# EAGLE design BigClown_WiFi_module (EAGLE 9.2.2)
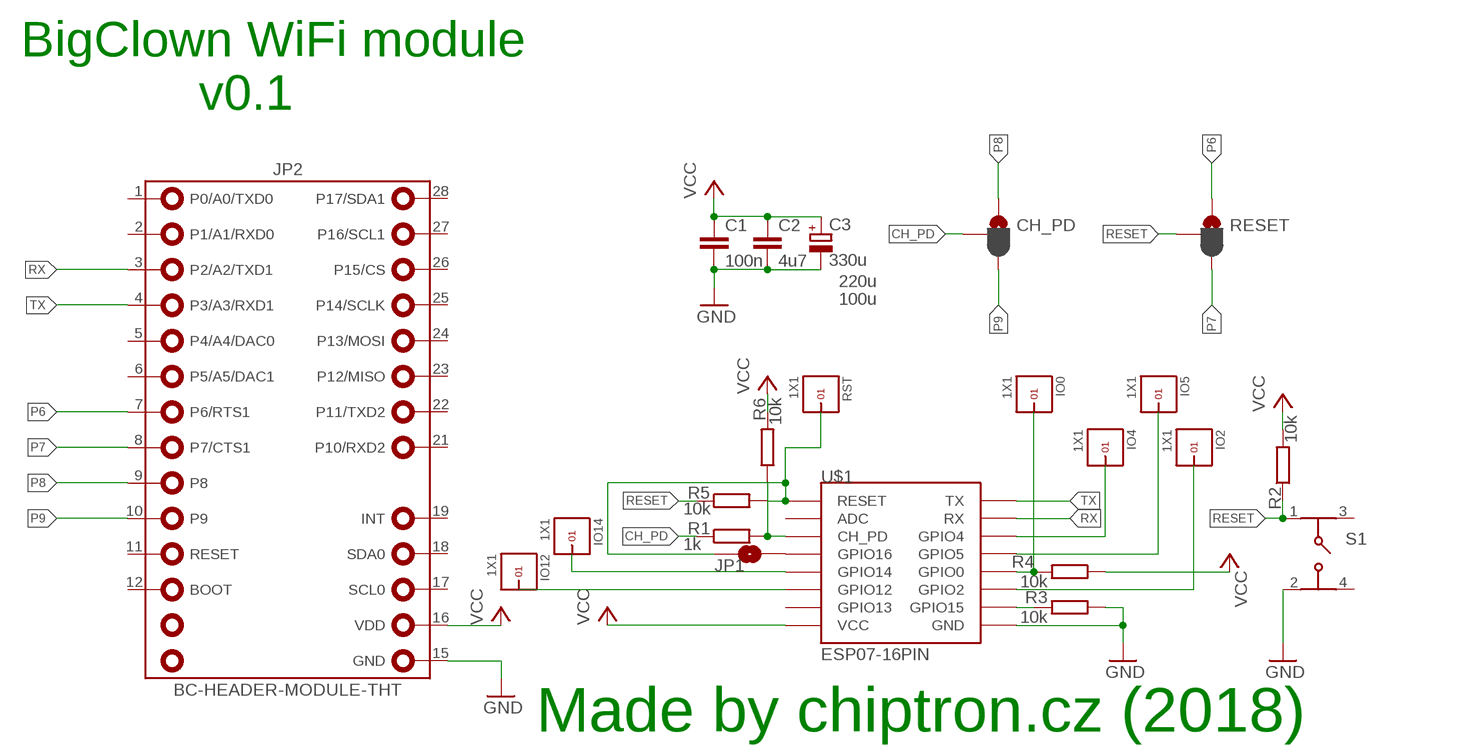
[diagram p0: schematic, sheet 1]

## Parts
C1  100n  C-EUC0805  [C0805]
C2  4u7  C-EUC1812K  [C1812K]
C3  330u  CPOL-EUD/7343-31R  [D/7343-31R]
CH_PD  JUMPER-SMT_3_1-NC_PASTE_SILK  [SMT-JUMPER_3_1-NC_PASTE_SILK]
IO0  1X1  [1X1]
IO2  1X1  [1X1]
IO4  1X1  [1X1]
IO5  1X1  [1X1]
IO12  1X1  [1X1]
IO14  1X1  [1X1]
JP1  JUMPER-SMT_2_NO_NO-SILK  [SMT-JUMPER_2_NO_NO-SILK]
JP2  BC-HEADER-MODULE-THT  [BC-HEADER-MODULE-THT]
R1  1k  R-EU_M0805  [M0805]
R2  10k  R-EU_M0805  [M0805]
R3  10k  R-EU_M0805  [M0805]
R4  10k  R-EU_M0805  [M0805]
R5  10k  R-EU_M0805  [M0805]
R6  10k  R-EU_M0805  [M0805]
RESET  JUMPER-SMT_3_1-NC_PASTE_SILK  [SMT-JUMPER_3_1-NC_PASTE_SILK]
RST  1X1  [1X1]
S1  430152043826  [430152043826]
U$1  ESP07-16PIN  [ESP07-16PIN]

## Nets
CH_PD: CH_PD.2 R1.1
GND: C1.2 C2.2 C3.- JP2.15(GND) R3.1 S1.2 U$1.GND
N$1: R1.2 R6.1 U$1.CH_PD
N$2: IO0.1 R4.2 U$1.GPIO0
N$3: R3.2 U$1.GPIO15
N$4: JP1.1 R5.2 RST.1 U$1.REST(RESET)
N$5: JP1.2 U$1.GPIO16
N$6: IO12.1 U$1.GPIO12
N$7: IO14.1 U$1.GPIO14
N$8: IO4.1 U$1.GPIO4
N$9: IO5.1 U$1.GPIO5
N$10: IO2.1 U$1.GPIO2
P6: JP2.7(P6/RTS1) RESET.1
P7: JP2.8(P7/CTS1) RESET.3
P8: CH_PD.1 JP2.9(P8)
P9: CH_PD.3 JP2.10(P9)
RESET: R2.1 R5.1 RESET.2 S1.1
RX: JP2.3(P2/A2/TXD1) U$1.RX
TX: JP2.4(P3/A3/RXD1) U$1.TX
VCC: C1.1 C2.1 C3.+ JP2.16(VDD) R2.2 R4.1 R6.2 U$1.VCC
Unconnected: JP2.1(P0/A0/TXD0) JP2.2(P1/A1/RXD03) JP2.5(P4/A4/DAC0) JP2.6(P5/A5/DAC1) JP2.11(RESET) JP2.12(BOOT) JP2.17(SCL0) JP2.18(SDA0) JP2.19(INT) JP2.21(P10/RXD2) JP2.22(P11/TXD2) JP2.23(P12/MISO) JP2.24(P13/MOSI) JP2.25(P14/SCLK) JP2.26(P15/CS) JP2.27(P16/SCL1) JP2.28(P17/SDA1) S1.3 S1.4 U$1.ADC U$1.GPIO13

## Notes on the sheet
- BigClown WiFi module
- v0.1
- 220u
- 100u
- Made by chiptron.cz (2018)

## Library data of the parts
C1 C2 = rcl:C-EU: CAPACITOR, European symbol; SPICEPREFIX: C
C3 = rcl:CPOL-EU: POLARIZED CAPACITOR, European symbol; SPICEPREFIX: C
CH_PD RESET = SparkFun-Jumpers:JUMPER-SMT_3_1-NC_PASTE: Normally closed solder jumper (1 of 2 connections) This jumper has an aperture in the stencil to allow solder paste to bridge one of the two connections. One connection is normally closed (NC), while the other is normally open (NO). Wick off the solder to open the connection. Reapply solder to reclose the connection. Apply solder to the other side instead to change the current path.
IO0 IO2 IO4 IO5 IO12 IO14 RST = headers_2mm:1X1
JP1 = SparkFun-Jumpers:JUMPER-SMT_2_NO: Normally open jumper This jumper has two pads in close proximity to each other. Apply solder to close the connection. Round pads are easier to solder for beginners, but are a lot larger. SparkFun Product that uses the round pads: SparkFun EL Sequencer <https://www.sparkfun.com/products/12781>
JP2 = bc-header:BC-HEADER-MODULE-THT: 14pin THT pin header or socket or long pin socket + 14pin THT pin header or socket or long pin socket empty pin 6 Use this pattern for THT connection only. Mounting Technology: THT; BCPN: -
R1-R6 = rcl:R-EU_: RESISTOR, European symbol; SPICEPREFIX: R
S1 = Wurth_Elektronik_Electromechanic_Switch_rev17c:430152043826: 6x6 mm SMD WS-TASV <http://katalog.we-online.de/media/images/v2/Family_WS-TASV_6x6mm_SMD_Tact_Switch_4301820xx8xx.jpg> Details see: http://katalog.we-online.de/em/datasheet/4301x2xxx8x6.pdf 2015 (C) Würth Elektronik
U$1 = esp8266modules:ESP07-16PIN: ESP8266 Wifi module 07 - 16 pins; DIMENSIONS: 22.0 x 16.0 mm; PINS: 16; PITCH: 0.078" / 2 mm

## Board
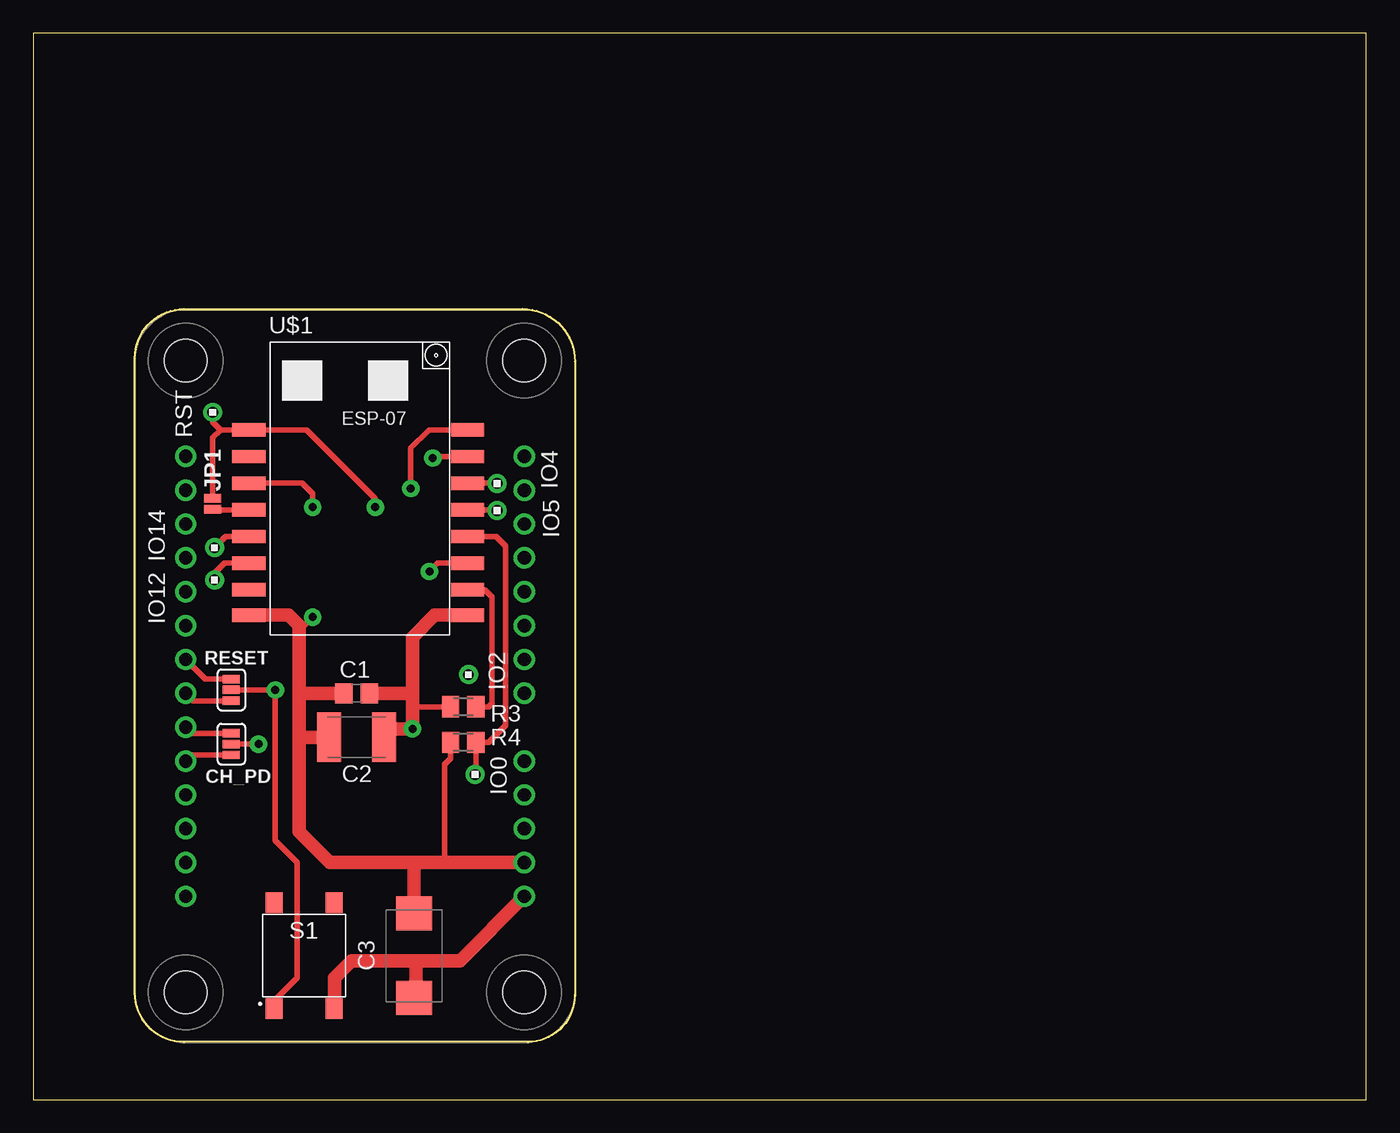
[diagram p1: board, top side]
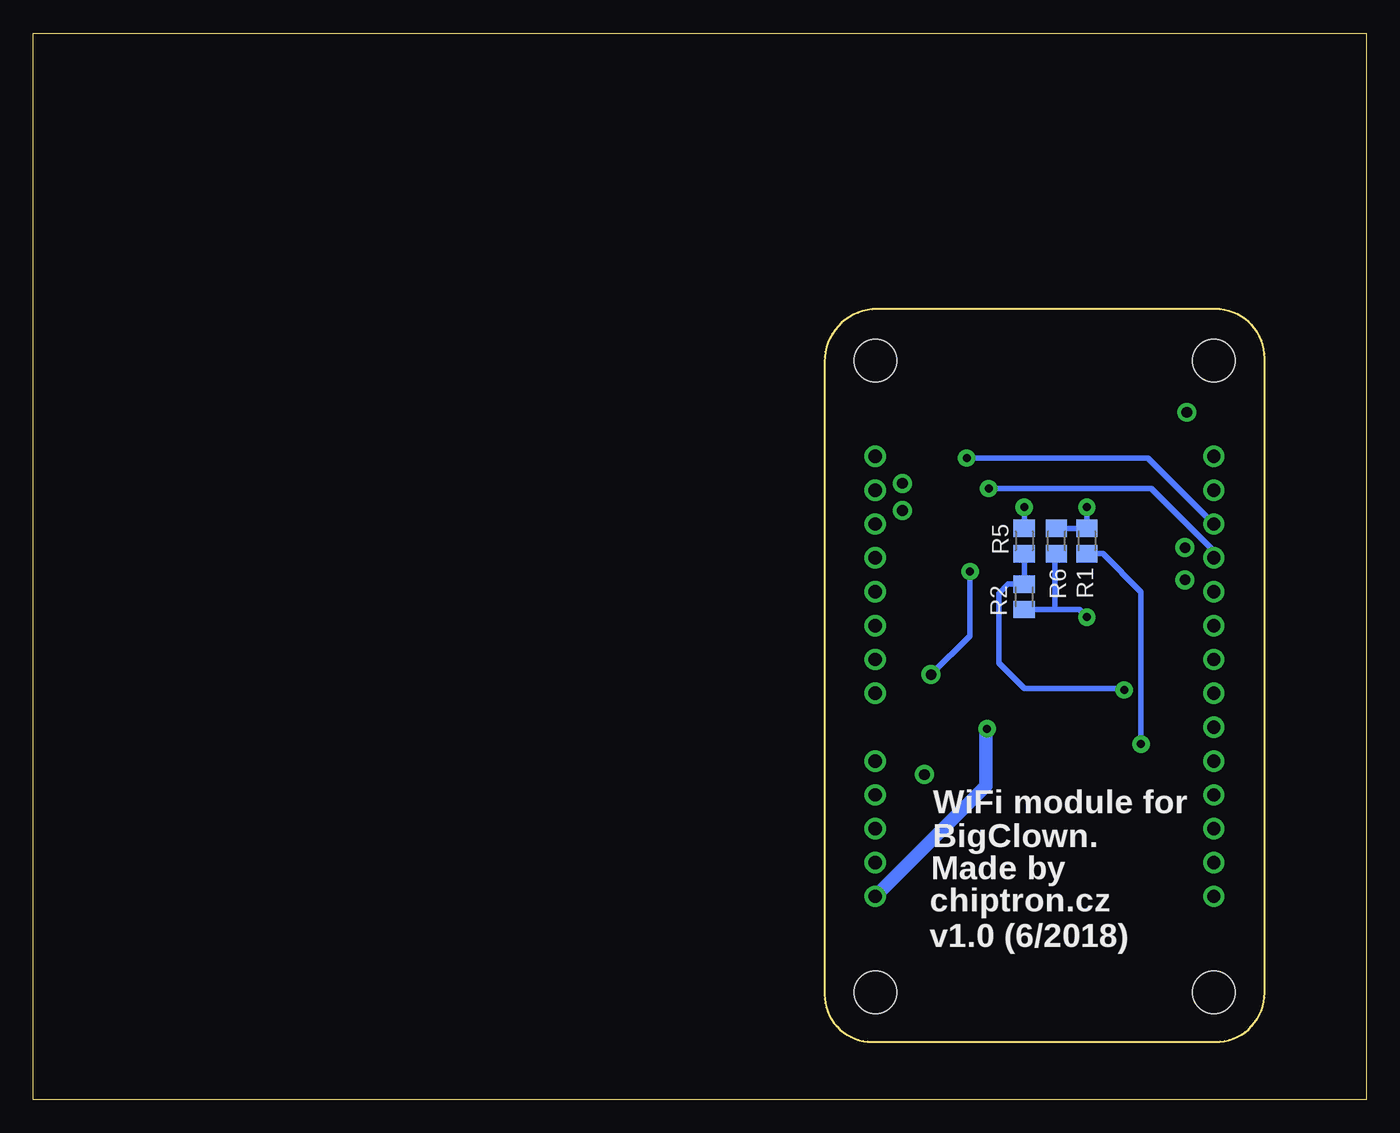
[diagram p2: board, bottom side, seen from below]

Size 100 x 80 mm. Coordinates in mm from the lower left corner, seen from the top.
Outline: 0,0 100,0 100,80 0,80 0,0
Copper layers (1*16): Top 0.035mm / dielectric 1.5mm / Bottom 0.035mm
Design rules "default": minimum track width 6mil, minimum drill 0.35mm, track to track 6mil, track to pad 6mil, pad to pad 6mil, via to via 6mil, smd to smd 6mil, copper to edge 40mil, drill to drill 6mil, minimum pad ring 10mil, minimum via ring 8mil, stop-mask expansion 4mil, vias tented up to drill 0mil, thermal gap 10mil
Milling: 8 lines

### Footprints (pad centres in the part's own frame; a part is rotated, then mirrored left to right if it is on the bottom)
C0805 = smd 1.3 x 1.5: 1 -0.95,0; 2 0.95,0
C1812K = smd 1.8 x 3.7: 1 -2.05,0; 2 2.05,0
D/7343-31R = smd 2.55 x 2.7: + 3.175,0; - -3.175,0
SMT-JUMPER_3_1-NC_PASTE_SILK = smd 0.635 x 1.27: 1 -0.813,0; 2 0,0; 3 0.813,0
1X1 = drill 0.8 pad 1.422: 1 0,0
SMT-JUMPER_2_NO_NO-SILK = smd 0.635 x 1.27: 1 -0.406,0; 2 0.406,0
BC-HEADER-MODULE-THT = drill 1 pad 1.6: 1 -12.7,16.51; 2 -12.7,13.97; 3 -12.7,11.43; 4 -12.7,8.89; 5 -12.7,6.35; 6 -12.7,3.81; 7 -12.7,1.27; 8 -12.7,-1.27; 9 -12.7,-3.81; 10 -12.7,-6.35; 11 -12.7,-8.89; 12 -12.7,-11.43; 13 -12.7,-13.97; 14 -12.7,-16.51; 15 12.7,-16.51; 16 12.7,-13.97; 17 12.7,-11.43; 18 12.7,-8.89; 19 12.7,-6.35; 21 12.7,-1.27; 22 12.7,1.27; 23 12.7,3.81; 24 12.7,6.35; 25 12.7,8.89; 26 12.7,11.43; 27 12.7,13.97; 28 12.7,16.51 | hole 3.2: -12.7,23.7; 12.7,23.7; -12.7,-23.7; 12.7,-23.7
M0805 = smd 1.3 x 1.6: 1 -0.95,0; 2 0.95,0
430152043826 = smd 1.55 x 1.3: 1 -3.975,2.25; 2 -3.975,-2.25; 3 3.975,2.25; 4 3.975,-2.25
ESP07-16PIN = smd 2.5 x 1: ADC -8.2,3.8; CH_PD -8.2,1.8; GND 8.2,-8.105; GPIO0 8.2,-2.2; GPIO2 8.2,-4.2; GPIO4 8.2,1.8; GPIO5 8.2,-0.2; GPIO12 -8.2,-4.2; GPIO13 -8.2,-6.2; GPIO14 -8.2,-2.2; GPIO15 8.2,-6.2; GPIO16 -8.2,-0.2; REST -8.2,5.8; RX 8.2,3.8; TX 8.2,5.8; VCC -8.2,-8.105

### Placement (x,y rotation side)
C1  24.26,30.48 0 top
C2  24.26,27.18 0 top
C3  28.57,10.79 90 top
CH_PD  14.86,26.67 270 top
IO0  33.15,24.38 0 top
IO2  32.64,31.88 0 top
IO4  34.8,46.23 0 top
IO5  34.8,44.2 0 top
IO12  13.59,38.99 0 top
IO14  13.59,41.4 0 top
JP1  13.46,44.7 270 top
JP2  24.13,31.75 0 top
R1  20.95,41.91 90 bottom
R2  25.65,37.72 270 bottom
R3  32.26,29.46 0 top
R4  32.26,26.8 0 top
R5  25.65,41.91 90 bottom
R6  23.24,41.91 270 bottom
RESET  14.86,30.73 270 top
RST  13.46,51.56 0 top
S1  20.32,10.79 90 top
U$1  24.38,44.45 0 top

### Tracks (layer width: path | path; a pad name or v marks a point on that pad's centre or on a via)
CH_PD  (via drill 0.6 pad 1.3)
  Top 0.406: v16.89,26.67 CH_PD.2
  Bottom 0.406: v16.89,26.67 16.89,38.1 19.75,40.96 R1.1
GND  (via drill 0.6 pad 1.3)
  Top 0.406: R3.1 28.7,29.46 28.45,31.37
  Top 1.016: S1.2 22.61,6.86 22.61,9.14 23.88,10.41 28.7,10.41 | 28.7,10.41 32,10.41 JP2.15 | C3.- 28.7,7.75 28.7,10.41 | 28.45,30.61 v28.45,27.81 26.94,27.81 C2.2 | 28.45,30.61 28.45,31.37 28.45,34.67 30.12,36.34 U$1.GND | C1.2 28.32,30.48 28.45,30.61
  Bottom 1.016: v28.45,27.81 28.54,27.72 28.54,23.53 JP2.15
N$1  (via drill 0.6 pad 1.3)
  Top 0.406: v20.95,44.45 20.95,45.47 20.17,46.25 U$1.CH_PD
  Bottom 0.406: v20.95,44.45 R1.2 R6.1
N$2
  Top 0.406: U$1.GPIO0 34.71,42.25 35.43,41.53 35.43,28.07 34.16,26.8 R4.2 33.21,24.45 IO0.1
N$3
  Top 0.406: R3.2 34.16,29.46 34.42,29.72 34.42,37.72 33.91,38.23 32.61,38.23 | 32.61,38.23 32.35,38.23 | U$1.GPIO15 32.61,38.23
N$4  (via drill 0.6 pad 1.3)
  Top 0.406: v25.65,44.45 25.65,45.09 20.49,50.25 U$1.REST 14.05,50.25 | 14.05,50.25 13.46,49.66 JP1.1 | 14.05,50.25 13.46,50.84 RST.1
  Bottom 0.406: R5.2 v25.65,44.45
N$5
  Top 0.406: U$1.GPIO16 13.51,44.25 JP1.2
N$6
  Top 0.406: IO12.1 13.59,39.5 14.34,40.25 U$1.GPIO12
N$7
  Top 0.406: U$1.GPIO14 14.44,42.25 IO14.1
N$8
  Top 0.406: IO4.1 34.78,46.25 U$1.GPIO4
N$9
  Top 0.406: IO5.1 34.74,44.25 U$1.GPIO5
N$10  (via drill 0.6 pad 1.3)
  Top 0.406: v29.72,39.62 30.34,40.25 U$1.GPIO2
  Bottom 0.406: v29.72,39.62 29.72,34.8 IO2.1
P6
  Top 0.406: RESET.1 12.9,31.55 JP2.7
P7
  Top 0.406: RESET.3 11.99,29.92 JP2.8
P8
  Top 0.406: CH_PD.1 11.89,27.48 JP2.9
P9
  Top 0.406: CH_PD.3 11.89,25.86 JP2.10
RESET  (via drill 0.6 pad 1.3)
  Top 0.406: RESET.2 v18.16,30.73 18.16,19.43 19.81,17.78 19.81,9.14 18.07,7.4 S1.1
  Bottom 0.406: R5.1 R2.1 26.86,38.67 27.56,37.97 27.56,32.77 25.65,30.86 18.16,30.86 v18.16,30.73
RX  (via drill 0.6 pad 1.3)
  Top 0.406: U$1.RX 30.09,48.25 v29.97,48.13
  Bottom 0.406: v29.97,48.13 16.38,48.13 JP2.3
TX  (via drill 0.6 pad 1.3)
  Top 0.406: v28.32,45.85 28.32,48.9 29.68,50.25 U$1.TX
  Bottom 0.406: v28.32,45.85 16.13,45.85 11.43,41.15 JP2.4
VCC  (via drill 0.6 pad 1.3)
  Top 0.406: v20.95,36.2 20.32,35.56 19.94,35.56 | 31.31,26.61 R4.1 31.31,25.59 30.86,25.15 30.86,18.03 31.11,17.78 | 20.07,25.91 19.94,25.78
  Top 1.016: 19.94,26.92 19.94,25.78 19.94,20.07 22.23,17.78 28.7,17.78 | 19.94,26.92 19.94,30.48 | 19.94,30.48 19.94,35.56 19.15,36.34 U$1.VCC | 28.7,17.78 31.11,17.78 JP2.16 | C3.+ 28.57,17.65 28.7,17.78 | C2.1 20.19,27.18 19.94,26.92 | C1.1 19.94,30.48
  Bottom 0.406: R2.2 23.37,36.77 | 23.37,36.77 21.53,36.77 v20.95,36.2 | R6.2 23.37,40.83 23.37,36.77

### Text on the board
tNames: RST | IO4 | IO5 | IO14 | IO12 | IO2 | IO0
bNames: WiFi module for | BigClown. | Made by | chiptron.cz | v1.0 (6/2018)